# Altium schematic sheet Sheet1.SchDoc
size A; SheetNumber: 1; SheetTotal: 1
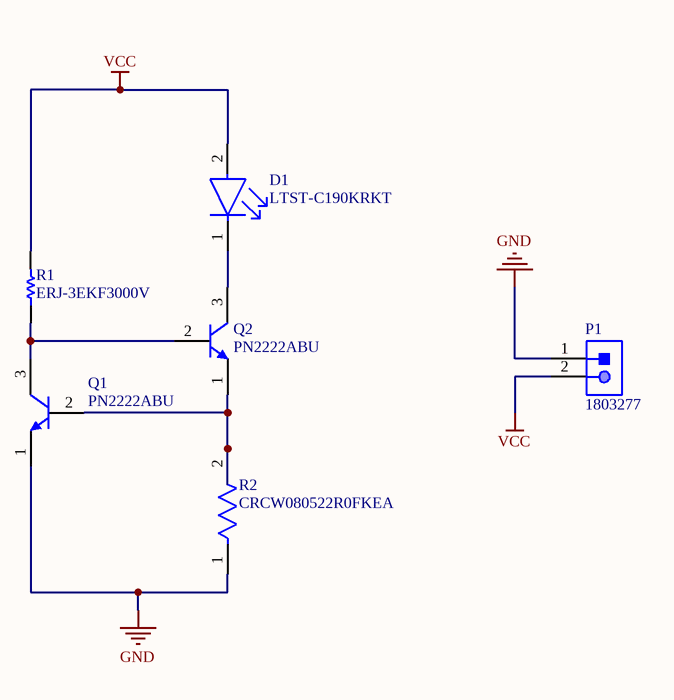
[diagram p0: Sheet1.SchDoc]

## Parts
D1  LTST-C190KRKT  [FP-LTST-C190KRKT-MFG]
P1  1803277  [PHOE-1803277_V]
Q1  PN2222ABU  [FAIR-TO-92]
Q2  PN2222ABU  [FAIR-TO-92]
R1  ERJ-3EKF3000V  [RESC1608X55X30LL15T15]
R2  CRCW080522R0FKEA  [FP-CRCW0805-e3-IPC_C]

## Nets
GND: P1.1 Q1.1(E) R2.1
VCC: D1.2(A) P1.2 R1.2
NetD1_1: D1.1(C) Q2.3(C)
NetQ1_2: Q1.2(B) Q2.1(E) R2.2
NetQ1_3: Q1.3(C) Q2.2(B) R1.1

## Library data of the parts
D1 = CMP-1674-00011-2: LED RED CLEAR CHIP SMD; Reverse Voltage: 5V; Viewing Angle: 130°; Power Rating: 75mW; Test Current: 20mA; Number of Elements: 1; Lens Color: Colorless; Wavelength: 639nm; Dominant Wavelength: 631nm; Lens Style: Diffused; Forward Current: 30mA; Forward Voltage: 2.4V; Luminous Intensity: 54mcd; Color: Red; Case Code (Imperial): 0603; Lens Transparency: Clear; Lead Free: Lead Free; Package Quantity: 1; Packaging: Tape and Reel; Max Operating Temperature: 85°C; Number of Pins: 2; Height: 0.8mm; Case/Package: 0603; Number of LEDs: 1; Width: 0.8mm; Case Code (Metric): 1608; Depth: 0.8mm; Mount: Surface Mount; Radiation Hardening: No; Length: 1.6mm; Illumination Color: Red; Power Dissipation: 75mW; Min Operating Temperature: -55°C
P1 = CMP-002-00014-2: Male Header, Pitch 3.81 mm, 1 x 2 Position, Height 7.25 mm, Tail Length 3.4 mm, RoHS, Bulk; Manufacturer: Phoenix Contact; Voltage Rating: 160V; Current Rating: 8A; Rows: 1; Mounting Technology: TH; Contact Plating: Tin; Case/Package: 1803277; Gender: Male; Diameter: 7.25mm; Datasheet Version: Feb-14; Colour: Green; Pins: 2; Lead Pitch: 0.15inch; Connector Type: Header; Package Quantity: 50; Max Current Rating: 8A; Manufacturer URL: http://www.phoenixcontact.com/; Packaging: Bulk; RoHS Compliant: True; Datasheet URL: https://datasheet.ciiva.com/16096/1803277-16096845.pdf; Package Reference: 1803277; Package Description: Male Header, Pitch 3.81 mm, 1 x 2 Position, Height 7.25 mm, Tail Length 3.4 mm
Q1 Q2 = CMP-013-00009-3: NPN General-Purpose Amplifier, 40 V, -55 to 150 degC, 3-Pin TO-92, RoHS, Bulk; Manufacturer: Fairchild; Power: 625mW; Elements: 1; hFE Min: 100; Vce Max: 1V; Frequency: 300MHz; Mounting Technology: TH; Package Quantity: 1000; RoHS Compliant: True; Datasheet Version: Rev. 1.1.0, 07/2014; Max Operating Temperature: 150°C; Min Operating Temperature: -55°C; Package Reference: TO-92; Package Description: 3-Pin Transistor Outline Package, Body Dia 4.79 mm, Pitch 1.27 mm; Pins: 3; Packaging: Bulk; Datasheet URL: https://www.fairchildsemi.com/datasheets/PN/PN2222A.pdf; Case/Package: TO-226-3
R1 = CMP-2000-00411-1: Manufacturer: Panasonic; Part Number: ERJ-3EKF3000V
R2 = CMP-2001-03692-2: RES Thick Film, 22Ω, 1%, 0.125W, 100ppm/°C, 0805; Resistance: 22R; Power Rating: 125mW; Voltage Rating: 150V; Case/Package: 0805; Radiation Hardening: No; Number of Terminations: 2; Termination: SMD/SMT; Package Quantity: 5000; Weight: 0.000194oz; Mount: Surface Mount; Lead Free: Lead Free; Height: 0.45mm; Composition: Thick Film; Min Operating Temperature: -55°C; Case Code (Metric): 2012; Temperature Coefficient: 100ppm/°C; Depth: 1.25mm; Packaging: Tape and Reel; Contact Plating: Tin; Width: 1.25mm; Case Code (Imperial): 0805; Length: 2mm; Max Operating Temperature: 155°C; Tolerance: 1%; Features: Automotive AEC-Q200; Military Standard: Not; Voltage Rating (DC): 150V; Max Power Dissipation: 125mW